# Altium schematic sheet Industrial-Controller_Temperature.SchDoc: Temp sensor
size 279 x 215 mm; Date: not used; ApprovedBy: not used; CheckedBy: not used; Author: not used; DrawnBy: not used; Organization: not used; Address4: not used; SheetNumber: 7; SheetTotal: 21; Time: not used; ImagePath: not used; Application_BuildNumber: not used
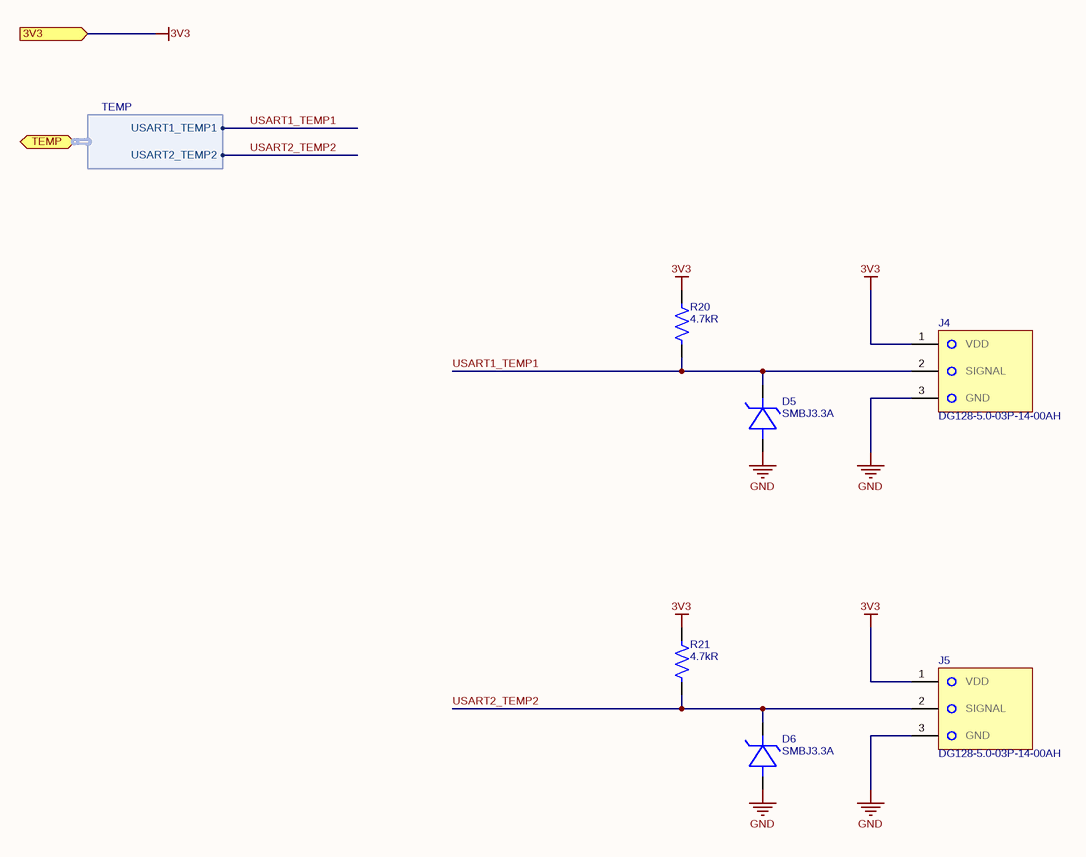
[diagram p0: Industrial-Controller_Temperature.SchDoc]

## Parts
D5  SMBJ3.3A  [SMB]
D6  SMBJ3.3A  [SMB]
J4  DG128-5.0-03P-14-00AH  [DG128-5.0-03P-14]
J5  DG128-5.0-03P-14-00AH  [DG128-5.0-03P-14]
R20  4.7kR  [RES_0603]
R21  4.7kR  [RES_0603]

## Ports
3V3 (in), TEMP (bidir, harness TEMP)

## Harnesses
TEMP: USART1_TEMP1, USART2_TEMP2

## Nets
3V3: J4.1 J5.1 R20.1 R21.1 ; port 3V3
GND: D5.2(A) D6.2(A) J4.3 J5.3
USART1_TEMP1: D5.1(C) J4.2 R20.2 ; port TEMP.USART1_TEMP1
USART2_TEMP2: D6.1(C) J5.2 R21.2 ; port TEMP.USART2_TEMP2

## Notes on the sheet
- Title:
- Date:
- Size A
- Project:
- Number:
- Time:
- Sheet
- Revision
- of
- Engineer:
- www.mrobots.ru <http://mrobots.ru/>
- File:

## Library data of the parts
D5 D6 = SMBJ3.3A: TVS DIODE 3.3VWM 4.1VC SMB; Manufacturer 1: JGD Semiconductors Co.,Ltd; Manufacturer Part Number 1: SMBJ3.3A
J4 J5 = DG128-5.0-03P-14: TERM BLK 3P TOP ENTRY 5MM SMD; Manufacturer 1: Degson; Number of Contacts: 3; Stripping Length: 7mm; Contact_1: VDD; Contact_2: SIGNAL; Contact_3: GND; Category: Uncategorized; Color: Green; Contact Material: Brass,Tin; Height: 17.6mm; Length: 10.2mm; Mount: Screw; Pitch: 5mm; Weight: 4g; Width: 15mm; Manufacturer Part Number 1: DG128-5.0-03P-14-00AH
R20 R21 = RC0603FR-074K7L: RES 4.7K OHM 1% 1/10W 0603; Manufacturer 1: Yageo; Power Rating: 100mW; Voltage Rating (DC): 50V; Temperature Coefficient: 100ppm/°C; Supplier 1: Arrow Electronics; RoHS: Yes; Category: Chip SMD Resistors; Stock 1: 14200000; Pricing 1: 5000=0,00180, 50000=0,00170, 125000=0,00140 (USD); Case/Package: 0603; Number of Pins: 2; Case Code (Imperial): 0603; Case Code (Metric): 1608; Size Code: 0603; Min Operating Temperature: -55°C; Max Operating Temperature: 155°C; Tolerance: 1%; Packaging: Tape and Reel; Resistance: 4.7kR; Resistor Type: Thick Film; Voltage Rating: 50V; Termination: SMD/SMT; Features: Moisture Resistant; Series: RC; Max Power Dissipation: 100mW; Number of Terminations: 2; Construction: Rectangular; Resistance Tolerance: 1%; Length: 1.6mm; Width: 0.8mm; Height: 0.45mm; Depth: 0.8mm; Lead Pitch: 0.3mm; REACH SVHC: No SVHC; Lead Free: Lead Free; RoHS Compliant: Yes; Military Standard: Not; ComponentLink1URL: https://datasheet.ciiva.com/15189/getdatasheetpartid-422754-15189760.pdf?src-supplier=Verical; ComponentLink1Description: https://datasheet.ciiva.com/15189/getdatasheetpartid-422754-15189760.pdf?src-supplier=Verical; ComponentLink2URL: https://datasheet.ciiva.com/7660/38590-7660794.pdf?src-supplier=Element14; ComponentLink2Description: https://datasheet.ciiva.com/7660/38590-7660794.pdf?src-supplier=Element14; ComponentLink3URL: https://datasheet.ciiva.com/22747/443971-22747528.pdf?src-supplier=Element14; ComponentLink3Description: https://datasheet.ciiva.com/22747/443971-22747528.pdf?src-supplier=Element14; ComponentLink4URL: https://datasheet.ciiva.com/46440/1868787-46440909.pdf?src-supplier=Element14; ComponentLink4Description: https://datasheet.ciiva.com/46440/1868787-46440909.pdf?src-supplier=Element14; ComponentLink5URL: https://datasheet.ciiva.com/7746/1868787-7746365.pdf?src-supplier=Element14; ComponentLink5Description: https://datasheet.ciiva.com/7746/1868787-7746365.pdf?src-supplier=Element14; ComponentLink6URL: https://datasheet.ciiva.com/7746/1738695-7746366.pdf?src-supplier=Element14; ComponentLink6Description: https://datasheet.ciiva.com/7746/1738695-7746366.pdf?src-supplier=Element14; Supplier Part Number 1: RC0603FR-074K7L; Manufacturer Part Number 1: RC0603FR-074K7L